# Altium schematic sheet Thermometer.SchDoc
size A4; SheetNumber: 4; SheetTotal: 4
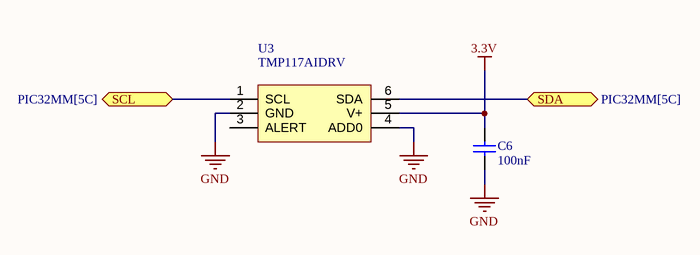
[diagram p0: Thermometer.SchDoc]

## Parts
C6  100nF  [Capacitor 0402]
U3  TMP117AIDRV  [WSON-6]

## Ports
SCL (bidir, see PIC32MM[5C]), SDA (bidir, see PIC32MM[5C])

## Nets
3.3V: C6.2 U3.5(V+)
GND: C6.1 U3.2(GND) U3.4(ADD0)
SCL: U3.1(SCL) ; port SCL
SDA: U3.6(SDA) ; port SDA

Not connected (* = marked no-connect by the designer): U3 3(ALERT)

## Notes on the sheet
- TITLE
- SIZE
- A4
- VARIANT
- PROJECT
- SHEET
- VERSION
- OF
- AUTHOR
- DATE

## Library data of the parts
C6 = Capacitor